# EAGLE design UCirKitUserStudy5-3 (EAGLE 7.3.0)
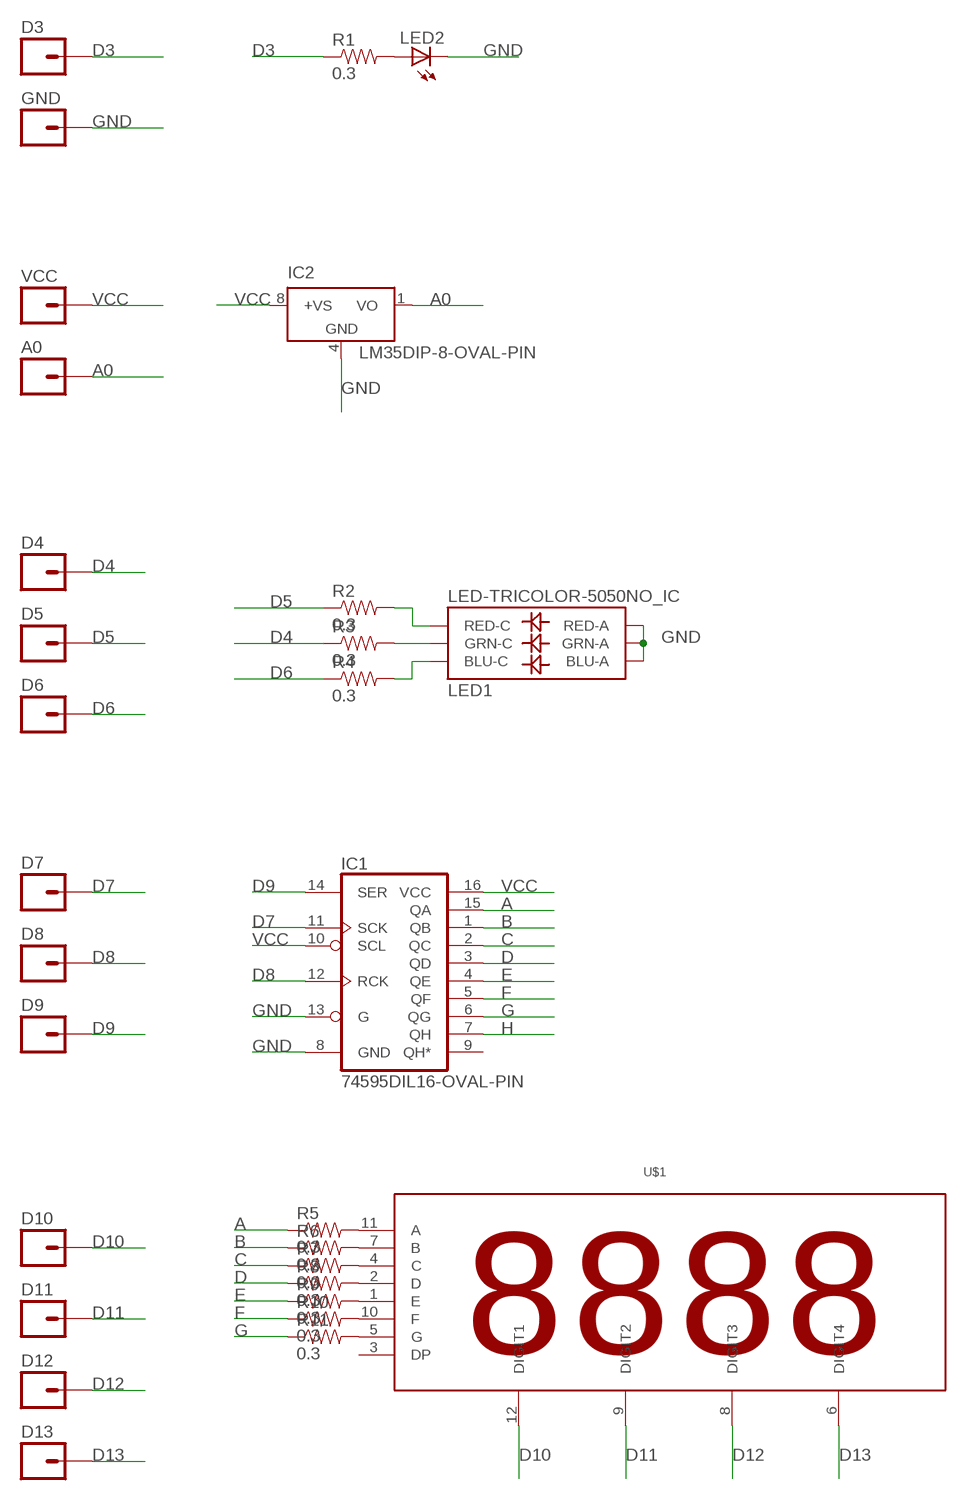
[diagram p0: schematic, sheet 1]

## Parts
A0  M01OVAL_PIN  [1X01_OVAL_PIN]
D3  M01OVAL_PIN  [1X01_OVAL_PIN]
D4  M01OVAL_PIN  [1X01_OVAL_PIN]
D5  M01OVAL_PIN  [1X01_OVAL_PIN]
D6  M01OVAL_PIN  [1X01_OVAL_PIN]
D7  M01OVAL_PIN  [1X01_OVAL_PIN]
D8  M01OVAL_PIN  [1X01_OVAL_PIN]
D9  M01OVAL_PIN  [1X01_OVAL_PIN]
D10  M01OVAL_PIN  [1X01_OVAL_PIN]
D11  M01OVAL_PIN  [1X01_OVAL_PIN]
D12  M01OVAL_PIN  [1X01_OVAL_PIN]
D13  M01OVAL_PIN  [1X01_OVAL_PIN]
GND  M01OVAL_PIN  [1X01_OVAL_PIN]
IC1  74595DIL16-OVAL-PIN  [DIL16-OVAL-PIN]
IC2  LM35DIP-8-OVAL-PIN  [DIP-8-OVAL-PIN]
LED1  LED-TRICOLOR-5050NO_IC  [LED-TRICOLOR-5050]
LED2  LEDCHIP-LED0805  [CHIP-LED0805]
R1  0.3  0.3OHM-1/8W-1%(0805)  [0805]
R2  0.3  0.3OHM-1/8W-1%(0805)  [0805]
R3  0.3  0.3OHM-1/8W-1%(0805)  [0805]
R4  0.3  0.3OHM-1/8W-1%(0805)  [0805]
R5  0.3  0.3OHM-1/8W-1%(0805)  [0805]
R6  0.3  0.3OHM-1/8W-1%(0805)  [0805]
R7  0.3  0.3OHM-1/8W-1%(0805)  [0805]
R8  0.3  0.3OHM-1/8W-1%(0805)  [0805]
R9  0.3  0.3OHM-1/8W-1%(0805)  [0805]
R10  0.3  0.3OHM-1/8W-1%(0805)  [0805]
R11  0.3  0.3OHM-1/8W-1%(0805)  [0805]
U$1  4DIGIT_SEVEN_SEGMENT4DIGIT_SEVEN_SEGMENT_OVAL_PIN  [4DIGIT_SEVEN_SEGMENT_OVAL_PIN]
VCC  M01OVAL_PIN  [1X01_OVAL_PIN]

## Nets
A: IC1.15(QA) R5.1
A0: A0.1 IC2.1(VO)
B: IC1.1(QB) R6.1
C: IC1.2(QC) R7.1
D: IC1.3(QD) R8.1
D3: D3.1 R1.1
D4: D4.1 R3.1
D5: D5.1 R2.1
D6: D6.1 R4.1
D7: D7.1 IC1.11(SCK)
D8: D8.1 IC1.12(RCK)
D9: D9.1 IC1.14(SER)
D10: D10.1 U$1.12(DIGIT1)
D11: D11.1 U$1.9(DIGIT2)
D12: D12.1 U$1.8(DIGIT3)
D13: D13.1 U$1.6(DIGIT4)
E: IC1.4(QE) R9.1
F: IC1.5(QF) R10.1
G: IC1.6(QG) R11.1
GND: GND.1 IC1.8(GND) IC1.13(G) IC2.4(GND) LED1.1(GRN-A) LED1.2(RED-A) LED1.3(BLU-A) LED2.C
H: IC1.7(QH)
N$1: R5.2 U$1.11(A)
N$2: R6.2 U$1.7(B)
N$3: R7.2 U$1.4(C)
N$4: R8.2 U$1.2(D)
N$5: R9.2 U$1.1(E)
N$6: R10.2 U$1.10(F)
N$7: R11.2 U$1.5(G)
N$8: LED1.5(RED-C) R2.2
N$9: LED1.6(GRN-C) R3.2
N$10: LED1.4(BLU-C) R4.2
N$11: LED2.A R1.2
VCC: IC1.10(SCL) IC1.16(VCC) IC2.8(+VS) VCC.1
Unconnected: IC1.9(QH*) U$1.3(DP)

## Library data of the parts
A0 D3-D13 GND VCC = SparkFun-Connectors:M01: Header 1 Standard 1-pin 0.1" header. Use with straight break away headers (SKU : PRT-00116), right angle break away headers (PRT-00553), swiss pins (PRT-00743), machine pins (PRT-00117), and female headers (PRT-00115).
IC1 = SparkFun-DigitalIC:74*595: 8-bit SHIFT REGISTER, output latch
IC2 = lm35:LM35: Single-Supply Centigrade Temperature Sensor Vout = (10mV/°C x Temp °C) +5mmmV Source: http://www.national.com/ds/LM/LM35.pdf
LED1 = SparkFun-LED:LED-TRICOLOR-5050
LED2 = led:LED: LED OSRAM: - CHIPLED LG R971, LG N971, LY N971, LG Q971, LY Q971, LO R971, LY R971 LH N974, LH R974 LS Q976, LO Q976, LY Q976 LO Q996 - Hyper CHIPLED LW Q18S LB Q993, LB Q99A, LB R99A - SideLED LS A670, LO A670, LY A670, LG A670, LP A670 LB A673, LV A673, LT A673, LW A673 LH A674 LY A675 LS A676, LA A676, LO A676, LY A676, LW A676 LS A679, LY A679, LG A679 - Hyper Micro SIDELED® LS Y876, LA Y876, LO Y876, LY Y876 LT Y87S - SmartLED LW L88C, LW L88S LB L89C, LB L89S, LG L890 LS L89K, LO L89K, LY L89K LS L896, LA L896, LO L896, LY L896 - TOPLED LS T670, LO T670, LY T670, LG T670, LP T670 LSG T670, LSP T670, LSY T670, LOP T670, LYG T670 LG T671, LOG T671, LSG T671 LB T673, LV T673, LT T673, LW T673 LH T674 LS T676, LA T676, LO T676, LY T676, LB T676, LH T676, LSB T676, LW T676 LB T67C, LV T67C, LT T67C, LS T67K, LO T67K, LY T67K, LW E67C LS E67B, LA E67B, LO E67B, LY E67B, LB E67C, LV E67C, LT E67C LW T67C LS T679, LY T679, LG T679 LS T770, LO T770, LY T770, LG T770, LP T770 LB T773, LV T773, LT T773, LW T773 LH T774 LS E675, LA E675, LY E675, LS T675 LS T776, LA T776, LO T776, LY T776, LB T776 LHGB T686 LT T68C, LB T68C - Hyper Mini TOPLED® LB M676 - Mini TOPLED Santana® LG M470 LS M47K, LO M47K, LY M47K Source: http://www.osram.convergy.de LUXEON: - LUMILED® LXK2-PW12-R00, LXK2-PW12-S00, LXK2-PW14-U00, LXK2-PW14-V00 LXK2-PM12-R00, LXK2-PM12-S00, LXK2-PM14-U00 LXK2-PE12-Q00, LXK2-PE12-R00, LXK2-PE12-S00, LXK2-PE14-T00, LXK2-PE14-U00 LXK2-PB12-K00, LXK2-PB12-L00, LXK2-PB12-M00, LXK2-PB14-N00, LXK2-PB14-P00, LXK2-PB14-Q00 LXK2-PR12-L00, LXK2-PR12-M00, LXK2-PR14-Q00, LXK2-PR14-R00 LXK2-PD12-Q00, LXK2-PD12-R00, LXK2-PD12-S00 LXK2-PH12-R00, LXK2-PH12-S00 LXK2-PL12-P00, LXK2-PL12-Q00, LXK2-PL12-R00 Source: www.luxeon.com KINGBRIGHT: KA-3528ASYC Source: www.kingbright.com
R1-R11 = SparkFun-Resistors:0.3OHM-1/8W-1%(0805): RES-11622; PROD_ID: RES-11622
U$1 = led-7-segment:4DIGIT_SEVEN_SEGMENT

## Board
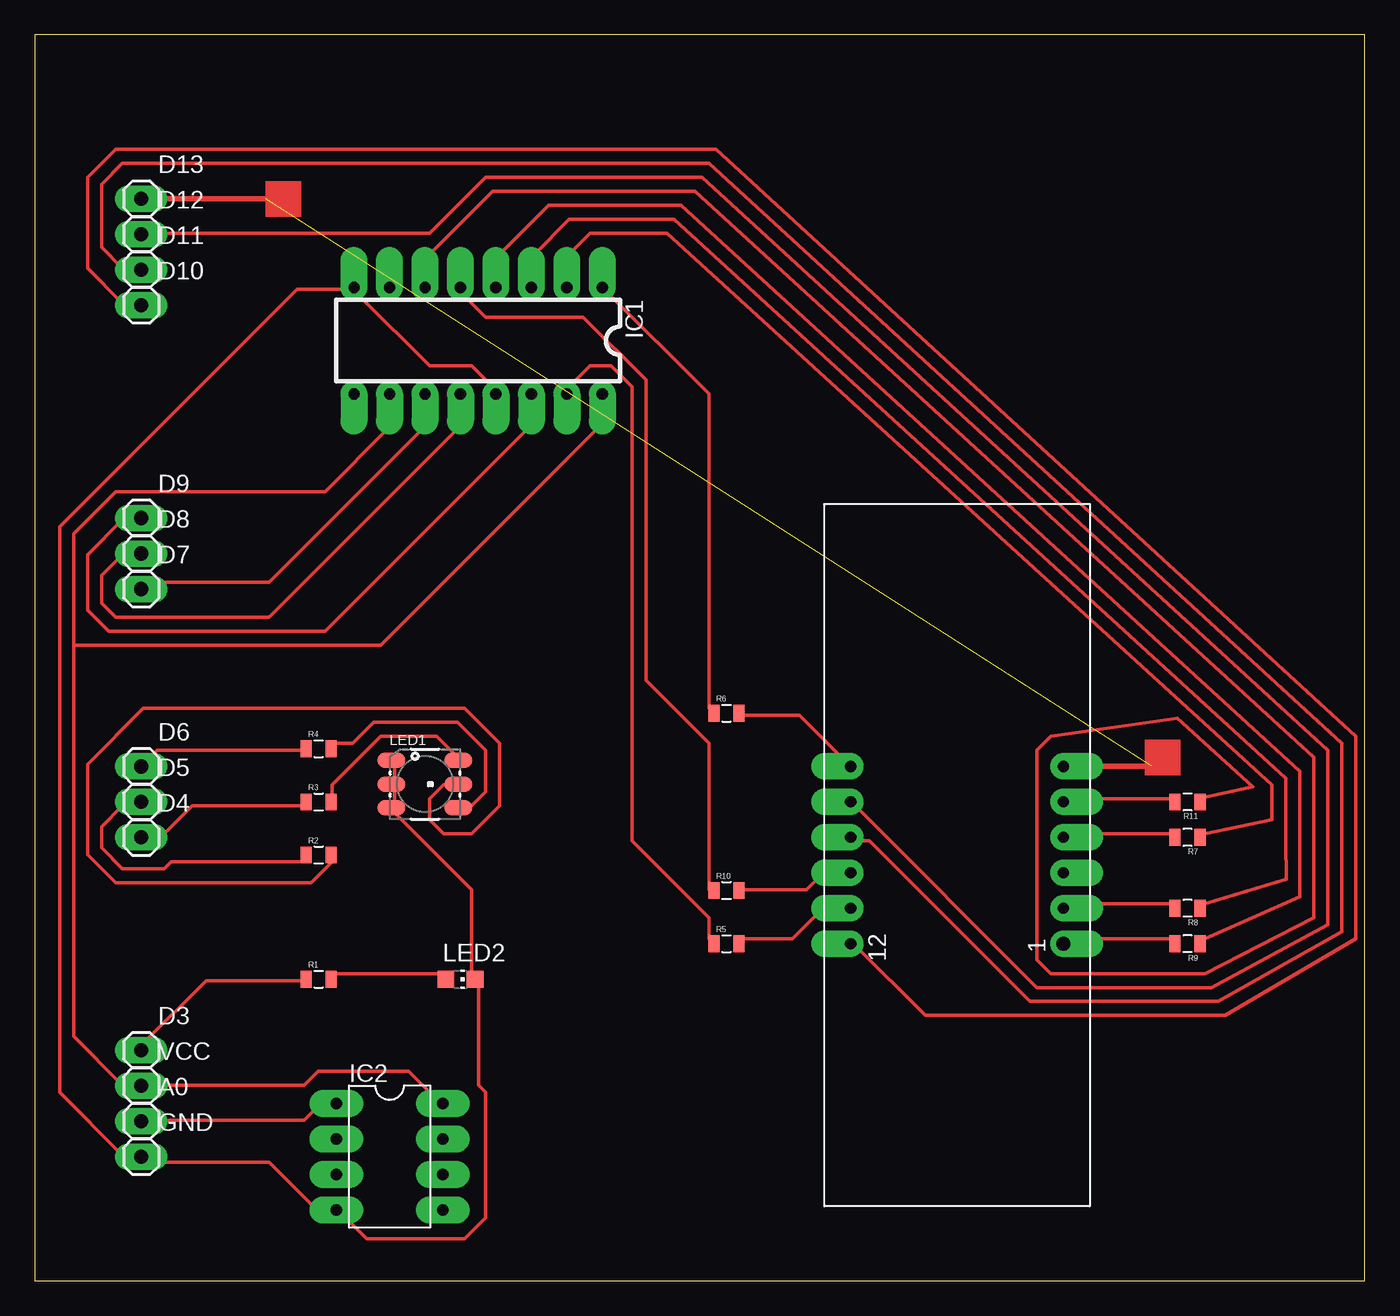
[diagram p1: board, top side]

Size 95.23 x 89.2 mm. Coordinates in mm from the lower left corner, seen from the top.
Outline: 0,0 95.23,0 95.23,89.2 0,89.2 0,0
Copper layers (1*16): Top 0.035mm / dielectric 1.5mm / Bottom 0.035mm
Design rules "default *": minimum track width 10mil, minimum drill 24mil, track to track 20mil, track to pad 30mil, pad to pad 9mil, via to via 9mil, smd to smd 8mil, copper to edge 40mil, drill to drill 8mil, minimum pad ring 10mil, minimum via ring 8mil, stop-mask expansion 4mil, vias tented up to drill 0mil, thermal gap 10mil

### Footprints (pad centres in the part's own frame; a part is rotated, then mirrored left to right if it is on the bottom)
1X01_OVAL_PIN = drill 1.016 pad 1.88 long: 1 0,0
DIL16-OVAL-PIN = drill 0.813 pad 1.93 offset: 1 -8.89,-3.81; 2 -6.35,-3.81; 3 -3.81,-3.81; 4 -1.27,-3.81; 5 1.27,-3.81; 6 3.81,-3.81; 7 6.35,-3.81; 8 8.89,-3.81; 9 8.89,3.81; 10 6.35,3.81; 11 3.81,3.81; 12 1.27,3.81; 13 -1.27,3.81; 14 -3.81,3.81; 15 -6.35,3.81; 16 -8.89,3.81
DIP-8-OVAL-PIN = drill 0.813 pad 1.93 long: 1 -3.81,-3.81; 2 -1.27,-3.81; 3 1.27,-3.81; 4 3.81,-3.81; 5 3.81,3.81; 6 1.27,3.81; 7 -1.27,3.81; 8 -3.81,3.81
LED-TRICOLOR-5050 = smd 2 x 1.1: 1 -2.4,1.7; 2 -2.4,0; 3 -2.4,-1.7; 4 2.4,-1.7; 5 2.4,0; 6 2.4,1.7
CHIP-LED0805 = smd 1.2 x 1.2: A 0,-1.05; C 0,1.05
0805 = smd 0.8 x 1.2: 1 -0.9,0; 2 0.9,0
4DIGIT_SEVEN_SEGMENT_OVAL_PIN = drill 1.016 pad 1.88 offset: 1 -6.35,-7.62 | drill 0.8 pad 1.88 offset: 2 -3.81,-7.62; 3 -1.27,-7.62; 4 1.27,-7.62; 5 3.81,-7.62; 6 6.35,-7.62; 7 6.35,7.62; 8 3.81,7.62; 9 1.27,7.62; 10 -1.27,7.62; 11 -3.81,7.62; 12 -6.35,7.62

### Placement (x,y rotation side)
A0  7.62,11.43 0 top
D3  7.62,16.51 0 top
D4  7.62,31.75 0 top
D5  7.62,34.29 0 top
D6  7.62,36.83 0 top
D7  7.62,49.53 0 top
D8  7.62,52.07 0 top
D9  7.62,54.61 0 top
D10  7.62,69.85 0 top
D11  7.62,72.39 0 top
D12  7.62,74.93 0 top
D13  7.62,77.47 0 top
GND  7.62,8.89 0 top
IC1  31.75,67.31 180 top
IC2  25.4,8.89 270 top
LED1  27.94,35.56 0 top
LED2  30.48,21.59 270 top
R1  20.32,21.59 0 top
R2  20.32,30.48 0 top
R3  20.32,34.29 0 top
R4  20.32,38.1 0 top
R5  49.53,24.13 0 top
R6  49.53,40.64 0 top
R7  82.55,31.75 180 top
R8  82.55,26.67 180 top
R9  82.55,24.13 180 top
R10  49.53,27.94 0 top
R11  82.55,34.29 180 top
U$1  66.04,30.48 90 top
VCC  7.62,13.97 0 top

### Tracks (layer width: path | path; a pad name or v marks a point on that pad's centre or on a via)
A
  Top 0.254: R5.1 48.27,24.5 48.27,26 42.77,31.5 42.77,64 41.27,65.5 39.77,65.5 37.77,63.5 IC1.15
A0
  Top 0.254: A0.1 7.77,11.5 19.27,11.5 20.27,12.5 21.27,12.5 IC2.1
B
  Top 0.254: R6.1 48.27,41 48.27,63.5 40.77,71 IC1.1
C
  Top 0.254: R7.1 83.77,32 88.58,33 88.58,35.5 45.27,75 39.77,75 38.27,73.5 38.27,71.5 IC1.2
D
  Top 0.254: R8.1 83.77,27 89.61,28.74 89.58,31.5 89.58,36 45.77,76 38.27,76 35.77,73.5 35.77,71.5 IC1.3
D3
  Top 0.254: R1.1 19.27,21.5 12.27,21.5 7.77,17 D3.1
D4
  Top 0.254: R3.1 19.27,34 11.27,34 9.27,32 7.77,32 D4.1
D5
  Top 0.254: R2.1 19.27,30 9.77,30 9.27,29.5 6.27,29.5 4.77,31 4.77,32.5 6.27,34 7.27,34 D5.1
D6
  Top 0.254: R4.1 19.27,38 8.77,38 7.77,37 D6.1
D7
  Top 0.254: D7.1 7.77,50 16.77,50 27.77,61 27.77,63.5 IC1.11
D8
  Top 0.254: D8.1 7.27,52 6.27,52 4.77,50.5 4.77,48.5 5.77,47.5 16.77,47.5 30.27,61 30.27,63.5 IC1.12
D9
  Top 0.254: D9.1 7.27,54.5 6.27,54.5 3.77,52 3.77,48 5.27,46.5 20.77,46.5 35.27,61 35.27,63.5 IC1.14
D10
  Top 0.254: D10.1 7.27,70 6.27,70 3.77,72.5 3.77,79 5.77,81 48.77,81 94.58,39 94.58,24.5 85.27,19 63.77,19 58.77,24 U$1.12
D11
  Top 0.254: U$1.9 58.77,31.5 59.77,31.5 71.27,20 84.77,20 93.58,25 93.58,38.5 48.27,80 6.27,80 4.77,78.5 4.77,74 6.27,72.5 7.27,72.5 D11.1
D12
  Top 0.254: D12.1 7.77,75 28.27,75 32.27,79 47.77,79 92.58,38 92.58,25.5 84.27,21 71.77,21 58.77,34 U$1.8
D13  (1 unrouted)
  Top 0.406: D13.1 16.51,77.47 | U$1.6 80.01,36.83
E
  Top 0.254: R9.1 83.77,24.5 90.58,27.5 90.58,36.5 46.27,77 36.77,77 33.27,73.5 33.27,71.5 IC1.4
F
  Top 0.254: R10.1 48.27,28 48.27,38.5 43.77,43 43.77,64.5 39.27,69 32.27,69 30.27,71 IC1.5
G
  Top 0.254: R11.1 83.27,34.5 87.21,35.38 81.81,40.27 72.77,39 71.77,38 71.77,23 72.77,22 83.77,22 91.58,26 91.58,37.5 47.27,78 32.77,78 28.27,73.5 28.27,71.5 IC1.6
GND
  Top 0.254: IC1.13 33.27,63.5 31.27,65.5 28.27,65.5 23.27,70.5 23.27,71 IC1.8 22.77,71 18.77,71 1.77,54 1.77,13.5 6.27,9 7.27,9 GND.1 7.77,8.5 16.77,8.5 19.77,5.5 21.27,5.5 IC2.4 21.77,5 23.77,3 30.77,3 32.27,4.5 32.27,13.5 31.77,14 31.77,21.5 LED2.C 31.27,22 31.27,28 25.77,33.5 LED1.3 25.77,34 25.77,35.5 LED1.2 25.77,36 25.77,37 LED1.1
N$1
  Top 0.254: R5.2 50.77,24.5 54.27,24.5 56.27,26.5 58.27,26.5 U$1.11
N$2
  Top 0.254: R6.2 50.77,40.5 54.77,40.5 58.27,37 U$1.7
N$3
  Top 0.254: R7.2 81.27,32 73.77,32 U$1.4
N$4
  Top 0.254: R8.2 81.27,27 73.77,27 U$1.2
N$5
  Top 0.254: R9.2 81.27,24.5 73.77,24.5 U$1.1
N$6
  Top 0.254: R10.2 50.77,28 55.27,28 56.27,29 58.27,29 U$1.10
N$7
  Top 0.254: R11.2 81.27,34.5 73.77,34.5 U$1.5
N$8
  Top 0.254: R2.2 21.27,30 19.77,28.5 5.77,28.5 3.77,30.5 3.77,37 7.77,41 30.77,41 33.27,38.5 33.27,34 31.27,32 29.27,32 28.27,33 28.27,34.5 29.27,35.5 30.27,35.5 LED1.5
N$9
  Top 0.254: R3.2 21.27,34.5 21.27,35.5 24.77,39 28.77,39 30.27,37.5 LED1.6
N$10
  Top 0.254: R4.2 21.27,38.5 22.77,38.5 24.27,40 30.27,40 32.27,38 32.27,35 30.77,33.5 LED1.4
N$11
  Top 0.254: R1.2 21.27,22 29.27,22 LED2.A
VCC
  Top 0.254: IC2.8 28.77,13 26.77,15 20.27,15 19.27,14 7.77,14 VCC.1 7.27,14 6.27,14 2.77,17.5 2.77,45.5 | 2.77,45.5 2.77,53.5 5.77,56.5 20.77,56.5 25.27,61 25.27,63.5 IC1.10 | 2.77,45.5 24.77,45.5 40.27,61 40.27,63.5 IC1.16
(copper drawn outside any net)
  shapes: Top area x2